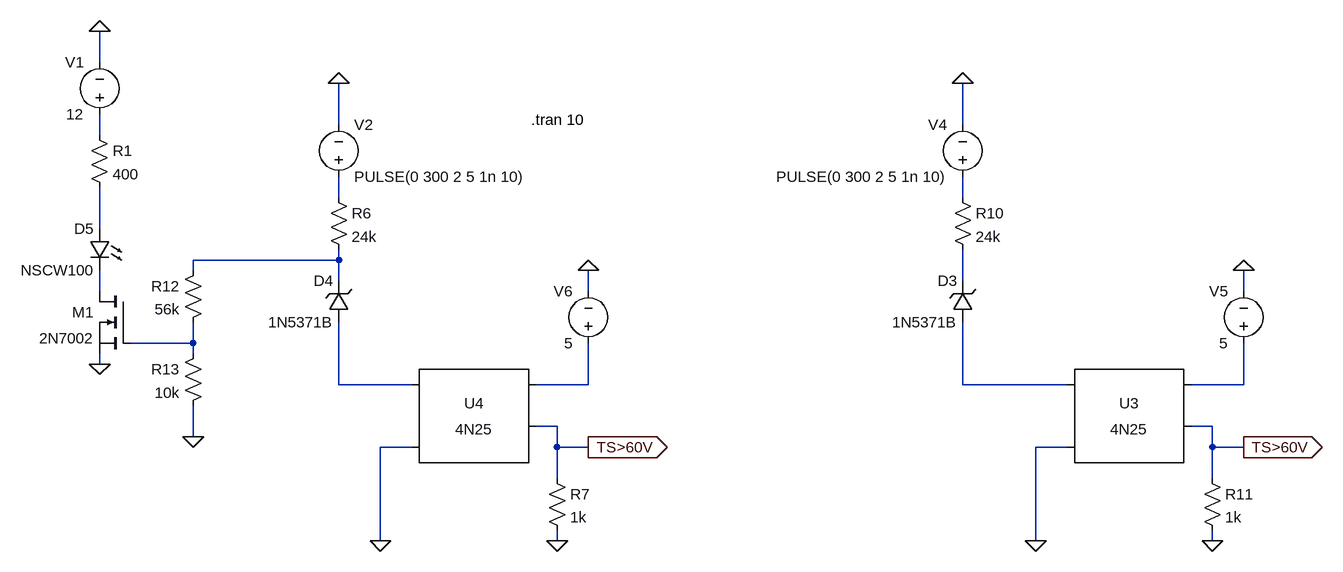
[diagram p0: schematic Voltage Measurement.asc]
Voltage Measurement.asc, the LTspice schematic file:
Version 4
SHEET 1 1400 1632
WIRE -592 880 -592 832
WIRE -224 976 -224 912
WIRE 736 976 736 912
WIRE -592 992 -592 960
WIRE -224 1088 -224 1056
WIRE 736 1088 736 1056
WIRE -592 1136 -592 1072
WIRE -224 1184 -224 1168
WIRE -224 1184 -448 1184
WIRE -448 1200 -448 1184
WIRE -224 1216 -224 1184
WIRE 736 1216 736 1168
WIRE -592 1232 -592 1200
WIRE 160 1232 160 1200
WIRE 1168 1232 1168 1200
WIRE -448 1312 -448 1280
WIRE -448 1312 -544 1312
WIRE -448 1328 -448 1312
WIRE -592 1344 -592 1328
WIRE -224 1376 -224 1280
WIRE -112 1376 -224 1376
WIRE 160 1376 160 1312
WIRE 160 1376 80 1376
WIRE 736 1376 736 1280
WIRE 896 1376 736 1376
WIRE 1168 1376 1168 1312
WIRE 1168 1376 1088 1376
WIRE 112 1440 80 1440
WIRE 1120 1440 1088 1440
WIRE -448 1456 -448 1408
WIRE -112 1472 -160 1472
WIRE 112 1472 112 1440
WIRE 160 1472 112 1472
WIRE 896 1472 848 1472
WIRE 1120 1472 1120 1440
WIRE 1168 1472 1120 1472
WIRE 112 1520 112 1472
WIRE 1120 1520 1120 1472
WIRE -160 1616 -160 1472
WIRE 112 1616 112 1600
WIRE 848 1616 848 1472
WIRE 1120 1616 1120 1600
FLAG 736 912 0
FLAG 848 1616 0
FLAG 1168 1472 TS>60V
IOPIN 1168 1472 Out
FLAG 1120 1616 0
FLAG 1168 1200 0
FLAG -224 912 0
FLAG -160 1616 0
FLAG 160 1472 TS>60V
IOPIN 160 1472 Out
FLAG 112 1616 0
FLAG 160 1200 0
FLAG -448 1456 0
FLAG -592 1344 0
FLAG -592 832 0
SYMBOL voltage 736 1072 R180
WINDOW 0 24 96 Left 2
WINDOW 3 24 16 Left 2
SYMATTR InstName V4
SYMATTR Value PULSE(0 300 2 5 1n 10)
SYMBOL Res 720 1072 R0
SYMATTR InstName R10
SYMATTR Value 24k
SYMBOL zener 752 1280 R180
WINDOW 0 24 64 Left 2
WINDOW 3 24 0 Left 2
SYMATTR InstName D3
SYMATTR Value 1N5371B
SYMBOL Optos/4N25 992 1440 R0
SYMATTR InstName U3
SYMBOL Voltage 1168 1328 R180
WINDOW 0 24 96 Left 2
WINDOW 3 24 16 Left 2
SYMATTR InstName V5
SYMATTR Value 5
SYMBOL Res 1104 1504 R0
SYMATTR InstName R11
SYMATTR Value 1k
SYMBOL voltage -224 1072 M180
WINDOW 0 24 96 Left 2
WINDOW 3 24 16 Left 2
SYMATTR InstName V2
SYMATTR Value PULSE(0 300 2 5 1n 10)
SYMBOL Res -240 1072 R0
SYMATTR InstName R6
SYMATTR Value 24k
SYMBOL zener -208 1280 R180
WINDOW 0 24 64 Left 2
WINDOW 3 24 0 Left 2
SYMATTR InstName D4
SYMATTR Value 1N5371B
SYMBOL Optos/4N25 -16 1440 R0
SYMATTR InstName U4
SYMBOL Voltage 160 1328 R180
WINDOW 0 24 96 Left 2
WINDOW 3 24 16 Left 2
SYMATTR InstName V6
SYMATTR Value 5
SYMBOL Res 96 1504 R0
SYMATTR InstName R7
SYMATTR Value 1k
SYMBOL Res -432 1184 M0
SYMATTR InstName R12
SYMATTR Value 56k
SYMBOL Res -432 1312 M0
SYMATTR InstName R13
SYMATTR Value 10k
SYMBOL nmos -544 1232 M0
SYMATTR InstName M1
SYMATTR Value 2N7002
SYMBOL LED -576 1136 M0
SYMATTR InstName D5
SYMATTR Value NSCW100
SYMBOL Voltage -592 976 R180
WINDOW 0 24 96 Left 2
WINDOW 3 24 16 Left 2
SYMATTR InstName V1
SYMATTR Value 12
SYMBOL Res -608 976 R0
SYMATTR InstName R1
SYMATTR Value 400
TEXT 72 968 Left 2 !.tran 10

The netlist it stands for:
* Voltage Measurement.asc
V4 N003 0 PULSE(0 300 2 5 1n 10)
R10 N003 N006 24k
D3 N011 N006 1N5371B
XU3 N011 0 N012 TS>60V NC_01 4N25
V5 N012 0 5
R11 TS>60V 0 1k
V2 N002 0 PULSE(0 300 2 5 1n 10)
R6 N002 N005 24k
D4 N009 N005 1N5371B
XU4 N009 0 N010 TS>60V NC_02 4N25
V6 N010 0 5
R7 TS>60V 0 1k
R12 N005 N008 56k
R13 N008 0 10k
M1 N007 N008 0 0 2N7002
D5 N004 N007 NSCW100
V1 N001 0 12
R1 N001 N004 400
.model D D
.lib standard.dio
.model NMOS NMOS
.model PMOS PMOS
.lib standard.mos
.tran 10
.lib 4N25.sub
.backanno
.end